# EAGLE schematic SDMAC (EAGLE 9.6.2)

## Sheet 1 of 3
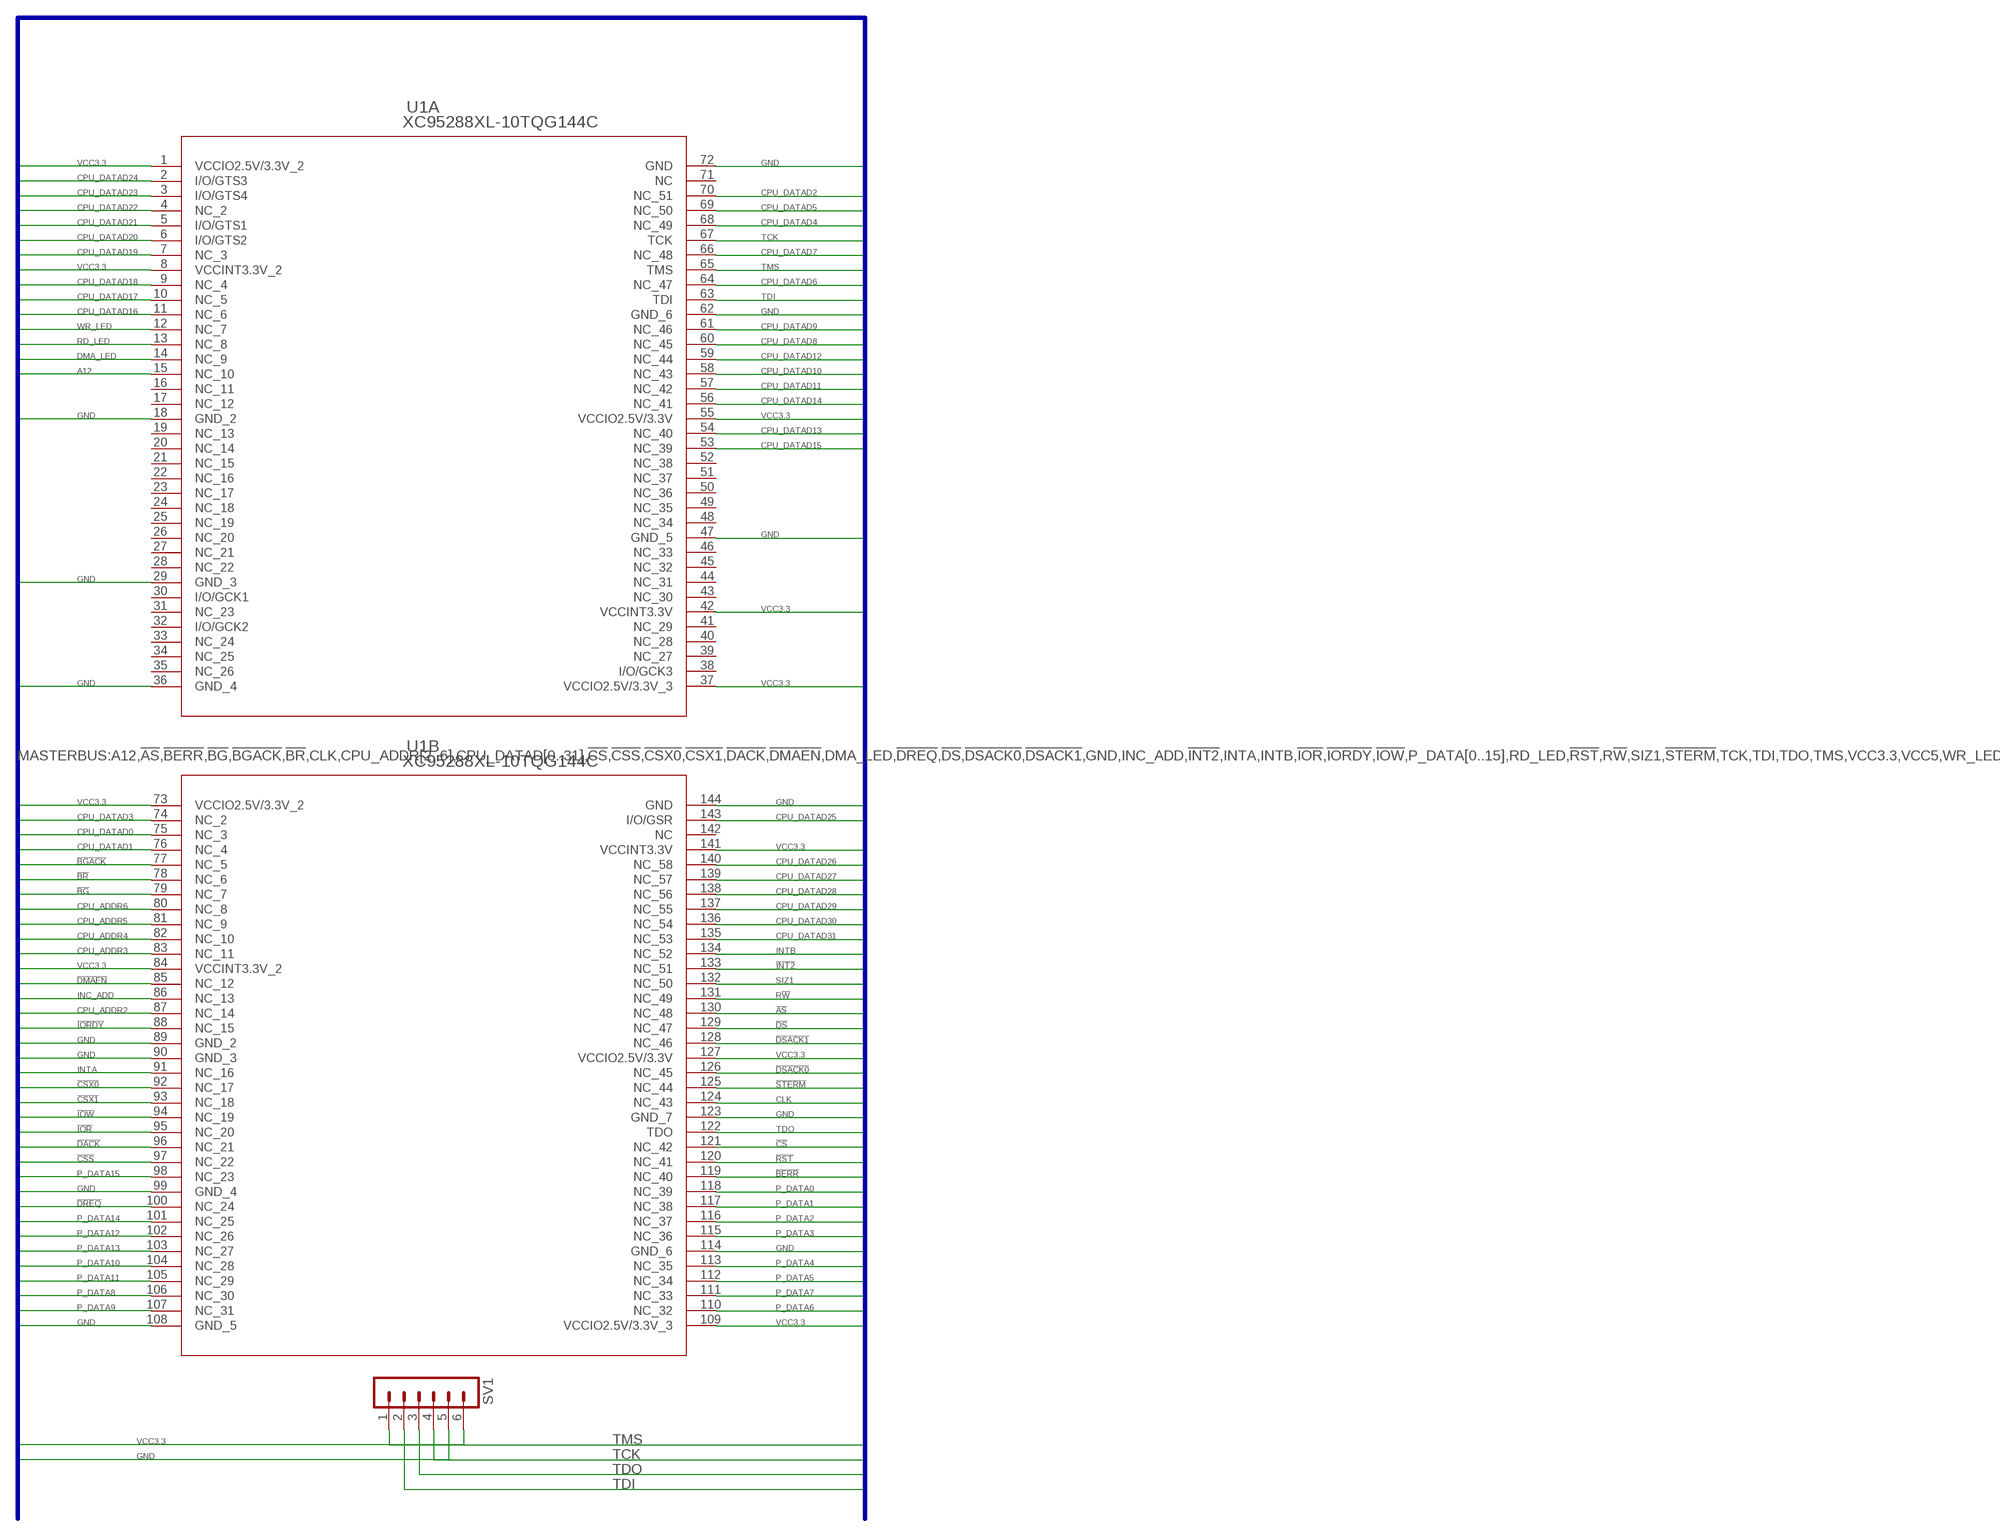
[diagram p0: schematic, sheet 1]

### Parts
SV1  MA06-1  [MA06-1]
U1  XC95288XL-10TQG144C  [144-TQFP_XIL]

### Nets
!AS: U1.130(B:NC_48) ; also sheet 2
!BERR: U1.119(B:NC_40) ; also sheet 2
!BG: U1.79(B:NC_7) ; also sheet 2
!BGACK: U1.77(B:NC_5) ; also sheet 2
!BR: U1.78(B:NC_6) ; also sheet 2
!CS: U1.121(B:NC_42) ; also sheet 2
!CSS: U1.97(B:NC_22) ; also sheet 2
!CSX0: U1.92(B:NC_17) ; also sheet 2
!CSX1: U1.93(B:NC_18) ; also sheet 2
!DACK: U1.96(B:NC_21) ; also sheet 2
!DMAEN: U1.85(B:NC_12) ; also sheet 2
!DREQ: U1.100(B:NC_24) ; also sheet 2
!DS: U1.129(B:NC_47) ; also sheet 2
!DSACK0: U1.126(B:NC_45) ; also sheet 2
!DSACK1: U1.128(B:NC_46) ; also sheet 2
!INT2: U1.133(B:NC_51) ; also sheet 2
!IOR: U1.95(B:NC_20) ; also sheet 2
!IORDY: U1.88(B:NC_15) ; also sheet 2
!IOW: U1.94(B:NC_19) ; also sheet 2
!RST: U1.120(B:NC_41) ; also sheet 2
!STERM: U1.125(B:NC_44) ; also sheet 2
A12: U1.15(A:NC_10) ; also sheet 3
CLK: U1.124(B:NC_43) ; also sheet 2
CPU_ADDR2: U1.87(B:NC_14) ; also sheet 2
CPU_ADDR3: U1.83(B:NC_11) ; also sheet 2
CPU_ADDR4: U1.82(B:NC_10) ; also sheet 2
CPU_ADDR5: U1.81(B:NC_9) ; also sheet 2
CPU_ADDR6: U1.80(B:NC_8) ; also sheet 2
CPU_DATAD0: U1.75(B:NC_3) ; also sheet 2
CPU_DATAD1: U1.76(B:NC_4) ; also sheet 2
CPU_DATAD2: U1.70(A:NC_51) ; also sheet 2
CPU_DATAD3: U1.74(B:NC_2) ; also sheet 2
CPU_DATAD4: U1.68(A:NC_49) ; also sheet 2
CPU_DATAD5: U1.69(A:NC_50) ; also sheet 2
CPU_DATAD6: U1.64(A:NC_47) ; also sheet 2
CPU_DATAD7: U1.66(A:NC_48) ; also sheet 2
CPU_DATAD8: U1.60(A:NC_45) ; also sheet 2
CPU_DATAD9: U1.61(A:NC_46) ; also sheet 2
CPU_DATAD10: U1.58(A:NC_43) ; also sheet 2
CPU_DATAD11: U1.57(A:NC_42) ; also sheet 2
CPU_DATAD12: U1.59(A:NC_44) ; also sheet 2
CPU_DATAD13: U1.54(A:NC_40) ; also sheet 2
CPU_DATAD14: U1.56(A:NC_41) ; also sheet 2
CPU_DATAD15: U1.53(A:NC_39) ; also sheet 2
CPU_DATAD16: U1.11(A:NC_6) ; also sheet 2
CPU_DATAD17: U1.10(A:NC_5) ; also sheet 2
CPU_DATAD18: U1.9(A:NC_4) ; also sheet 2
CPU_DATAD19: U1.7(A:NC_3) ; also sheet 2
CPU_DATAD20: U1.6(A:I/O/GTS2) ; also sheet 2
CPU_DATAD21: U1.5(A:I/O/GTS1) ; also sheet 2
CPU_DATAD22: U1.4(A:NC_2) ; also sheet 2
CPU_DATAD23: U1.3(A:I/O/GTS4) ; also sheet 2
CPU_DATAD24: U1.2(A:I/O/GTS3) ; also sheet 2
CPU_DATAD25: U1.143(B:I/O/GSR) ; also sheet 2
CPU_DATAD26: U1.140(B:NC_58) ; also sheet 2
CPU_DATAD27: U1.139(B:NC_57) ; also sheet 2
CPU_DATAD28: U1.138(B:NC_56) ; also sheet 2
CPU_DATAD29: U1.137(B:NC_55) ; also sheet 2
CPU_DATAD30: U1.136(B:NC_54) ; also sheet 2
CPU_DATAD31: U1.135(B:NC_53) ; also sheet 2
DMA_LED: U1.14(A:NC_9) ; also sheet 3
GND: SV1.5 U1.18(A:GND_2) U1.29(A:GND_3) U1.36(A:GND_4) U1.47(A:GND_5) U1.62(A:GND_6) U1.72(A:GND) U1.89(B:GND_2) U1.90(B:GND_3) U1.99(B:GND_4) U1.108(B:GND_5) U1.114(B:GND_6) U1.123(B:GND_7) U1.144(B:GND) ; also sheet 2,3
INC_ADD: U1.86(B:NC_13) ; also sheet 2
INTA: U1.91(B:NC_16) ; also sheet 2
INTB: U1.134(B:NC_52) ; also sheet 2
P_DATA0: U1.118(B:NC_39) ; also sheet 2
P_DATA1: U1.117(B:NC_38) ; also sheet 2
P_DATA2: U1.116(B:NC_37) ; also sheet 2
P_DATA3: U1.115(B:NC_36) ; also sheet 2
P_DATA4: U1.113(B:NC_35) ; also sheet 2
P_DATA5: U1.112(B:NC_34) ; also sheet 2
P_DATA6: U1.110(B:NC_32) ; also sheet 2
P_DATA7: U1.111(B:NC_33) ; also sheet 2
P_DATA8: U1.106(B:NC_30) ; also sheet 2
P_DATA9: U1.107(B:NC_31) ; also sheet 2
P_DATA10: U1.104(B:NC_28) ; also sheet 2
P_DATA11: U1.105(B:NC_29) ; also sheet 2
P_DATA12: U1.102(B:NC_26) ; also sheet 2
P_DATA13: U1.103(B:NC_27) ; also sheet 2
P_DATA14: U1.101(B:NC_25) ; also sheet 2
P_DATA15: U1.98(B:NC_23) ; also sheet 2
R!W: U1.131(B:NC_49) ; also sheet 2
RD_LED: U1.13(A:NC_8) ; also sheet 3
SIZ1: U1.132(B:NC_50) ; also sheet 2
TCK: SV1.4 U1.67(A:TCK)
TDI: SV1.2 U1.63(A:TDI)
TDO: SV1.3 U1.122(B:TDO)
TMS: SV1.1 U1.65(A:TMS)
VCC3.3: SV1.6 U1.1(A:VCCIO2.5V/3.3V_2) U1.8(A:VCCINT3.3V_2) U1.37(A:VCCIO2.5V/3.3V_3) U1.42(A:VCCINT3.3V) U1.55(A:VCCIO2.5V/3.3V) U1.73(B:VCCIO2.5V/3.3V_2) U1.84(B:VCCINT3.3V_2) U1.109(B:VCCIO2.5V/3.3V_3) U1.127(B:VCCIO2.5V/3.3V) U1.141(B:VCCINT3.3V) ; also sheet 3
WR_LED: U1.12(A:NC_7) ; also sheet 3
Unconnected: U1.16(A:NC_11) U1.17(A:NC_12) U1.19(A:NC_13) U1.20(A:NC_14) U1.21(A:NC_15) U1.22(A:NC_16) U1.23(A:NC_17) U1.24(A:NC_18) U1.25(A:NC_19) U1.26(A:NC_20) U1.27(A:NC_21) U1.28(A:NC_22) U1.30(A:I/O/GCK1) U1.31(A:NC_23) U1.32(A:I/O/GCK2) U1.33(A:NC_24) U1.34(A:NC_25) U1.35(A:NC_26) U1.38(A:I/O/GCK3) U1.39(A:NC_27) U1.40(A:NC_28) U1.41(A:NC_29) U1.43(A:NC_30) U1.44(A:NC_31) U1.45(A:NC_32) U1.46(A:NC_33) U1.48(A:NC_34) U1.49(A:NC_35) U1.50(A:NC_36) U1.51(A:NC_37) U1.52(A:NC_38) U1.71(A:NC) U1.142(B:NC)

### Buses
MASTERBUS:A12,!AS,!BERR,!BG,!BGACK,!BR,CLK,CPU_ADDR[2..6],CPU_DATAD[0..31],!CS,!CSS,!CSX0,!CSX1,!DACK,!DMAEN,DMA_LED,!DREQ,!DS,!DSACK0,!DSACK1,GND,INC_ADD,!INT2,INTA,INTB,!IOR,!IORDY,!IOW,P_DATA[0..15],RD_LED,!RST,R!W,SIZ1,!STERM,TCK,TDI,TDO,TMS,VCC3.3,VCC5,WR_LED

## Sheet 2 of 3
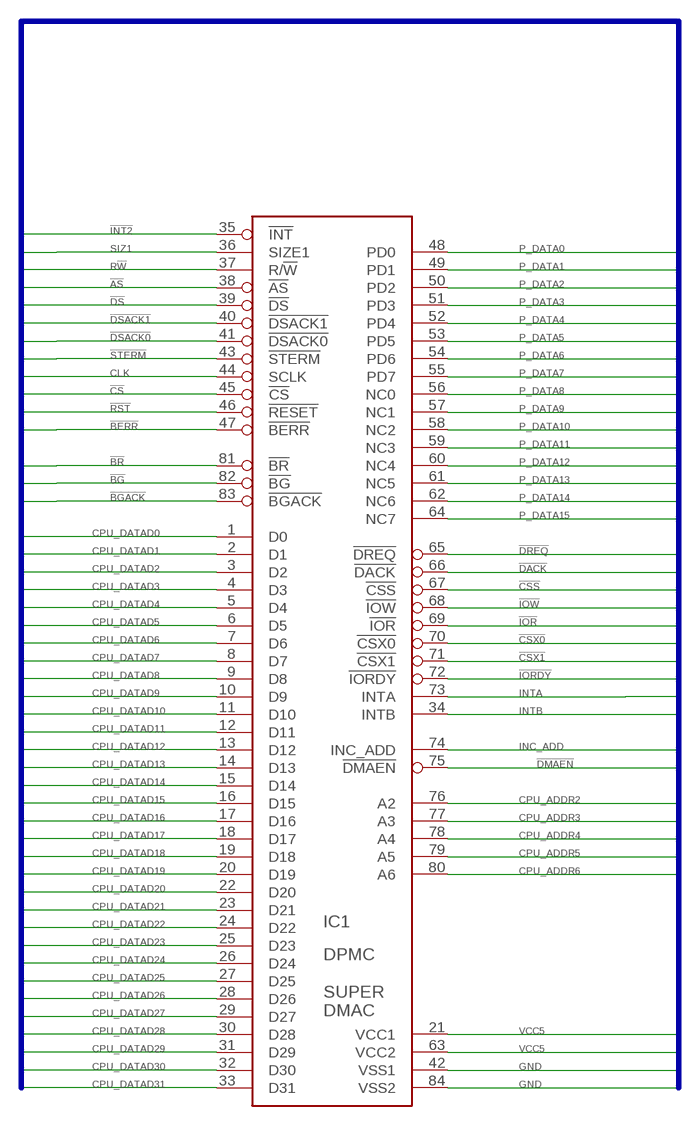
[diagram p1: schematic, sheet 2]

### Parts
IC1  SUPER_DMAC_THT  [PLCC84_T]

### Nets
!AS: IC1.38(!AS) ; also sheet 1
!BERR: IC1.47(!BERR) ; also sheet 1
!BG: IC1.82(!BG) ; also sheet 1
!BGACK: IC1.83(!BGACK) ; also sheet 1
!BR: IC1.81(!BR) ; also sheet 1
!CS: IC1.45(!CS) ; also sheet 1
!CSS: IC1.67(!CSS) ; also sheet 1
!CSX0: IC1.70(!CSX0) ; also sheet 1
!CSX1: IC1.71(!CSX1) ; also sheet 1
!DACK: IC1.66(!DACK) ; also sheet 1
!DMAEN: IC1.75(!DMAEN) ; also sheet 1
!DREQ: IC1.65(!DREQ) ; also sheet 1
!DS: IC1.39(!DS) ; also sheet 1
!DSACK0: IC1.41(!DSACK0) ; also sheet 1
!DSACK1: IC1.40(!DSACK1) ; also sheet 1
!INT2: IC1.35(!INT) ; also sheet 1
!IOR: IC1.69(!IOR) ; also sheet 1
!IORDY: IC1.72(!IORDY) ; also sheet 1
!IOW: IC1.68(!IOW) ; also sheet 1
!RST: IC1.46(!RESET) ; also sheet 1
!STERM: IC1.43(!STERM) ; also sheet 1
CLK: IC1.44(SCLK) ; also sheet 1
CPU_ADDR2: IC1.76(A2) ; also sheet 1
CPU_ADDR3: IC1.77(A3) ; also sheet 1
CPU_ADDR4: IC1.78(A4) ; also sheet 1
CPU_ADDR5: IC1.79(A5) ; also sheet 1
CPU_ADDR6: IC1.80(A6) ; also sheet 1
CPU_DATAD0: IC1.1(D0) ; also sheet 1
CPU_DATAD1: IC1.2(D1) ; also sheet 1
CPU_DATAD2: IC1.3(D2) ; also sheet 1
CPU_DATAD3: IC1.4(D3) ; also sheet 1
CPU_DATAD4: IC1.5(D4) ; also sheet 1
CPU_DATAD5: IC1.6(D5) ; also sheet 1
CPU_DATAD6: IC1.7(D6) ; also sheet 1
CPU_DATAD7: IC1.8(D7) ; also sheet 1
CPU_DATAD8: IC1.9(D8) ; also sheet 1
CPU_DATAD9: IC1.10(D9) ; also sheet 1
CPU_DATAD10: IC1.11(D10) ; also sheet 1
CPU_DATAD11: IC1.12(D11) ; also sheet 1
CPU_DATAD12: IC1.13(D12) ; also sheet 1
CPU_DATAD13: IC1.14(D13) ; also sheet 1
CPU_DATAD14: IC1.15(D14) ; also sheet 1
CPU_DATAD15: IC1.16(D15) ; also sheet 1
CPU_DATAD16: IC1.17(D16) ; also sheet 1
CPU_DATAD17: IC1.18(D17) ; also sheet 1
CPU_DATAD18: IC1.19(D18) ; also sheet 1
CPU_DATAD19: IC1.20(D19) ; also sheet 1
CPU_DATAD20: IC1.22(D20) ; also sheet 1
CPU_DATAD21: IC1.23(D21) ; also sheet 1
CPU_DATAD22: IC1.24(D22) ; also sheet 1
CPU_DATAD23: IC1.25(D23) ; also sheet 1
CPU_DATAD24: IC1.26(D24) ; also sheet 1
CPU_DATAD25: IC1.27(D25) ; also sheet 1
CPU_DATAD26: IC1.28(D26) ; also sheet 1
CPU_DATAD27: IC1.29(D27) ; also sheet 1
CPU_DATAD28: IC1.30(D28) ; also sheet 1
CPU_DATAD29: IC1.31(D29) ; also sheet 1
CPU_DATAD30: IC1.32(D30) ; also sheet 1
CPU_DATAD31: IC1.33(D31) ; also sheet 1
GND: IC1.42(VSS1) IC1.84(VSS2) ; also sheet 1,3
INC_ADD: IC1.74(INC_ADD) ; also sheet 1
INTA: IC1.73(INTA) ; also sheet 1
INTB: IC1.34(INTB) ; also sheet 1
P_DATA0: IC1.48(PD0) ; also sheet 1
P_DATA1: IC1.49(PD1) ; also sheet 1
P_DATA2: IC1.50(PD2) ; also sheet 1
P_DATA3: IC1.51(PD3) ; also sheet 1
P_DATA4: IC1.52(PD4) ; also sheet 1
P_DATA5: IC1.53(PD5) ; also sheet 1
P_DATA6: IC1.54(PD6) ; also sheet 1
P_DATA7: IC1.55(PD7) ; also sheet 1
P_DATA8: IC1.56(NC0) ; also sheet 1
P_DATA9: IC1.57(NC1) ; also sheet 1
P_DATA10: IC1.58(NC2) ; also sheet 1
P_DATA11: IC1.59(NC3) ; also sheet 1
P_DATA12: IC1.60(NC4) ; also sheet 1
P_DATA13: IC1.61(NC5) ; also sheet 1
P_DATA14: IC1.62(NC6) ; also sheet 1
P_DATA15: IC1.64(NC7) ; also sheet 1
R!W: IC1.37(R/!W!) ; also sheet 1
SIZ1: IC1.36(SIZE1) ; also sheet 1
VCC5: IC1.21(VCC1) IC1.63(VCC2) ; also sheet 3

### Buses
!AS,!BERR,!BG,!BGACK,!BR,CLK,CPU_ADDR[2..6],CPU_DATAD[0..31],!CS,!CSS,!CSX0,!CSX1,!DACK,!DMAEN,!DREQ,!DS,!DSACK0,!DSACK1,GND,INC_ADD,!INT2,INTA,INTB,!IOR,!IORDY,!IOW,P_DATA[0..15],!RST,R!W,SIZ1,!STERM,TCK,TDI,TDO,TMS,VCC3.3,VCC5

## Sheet 3 of 3
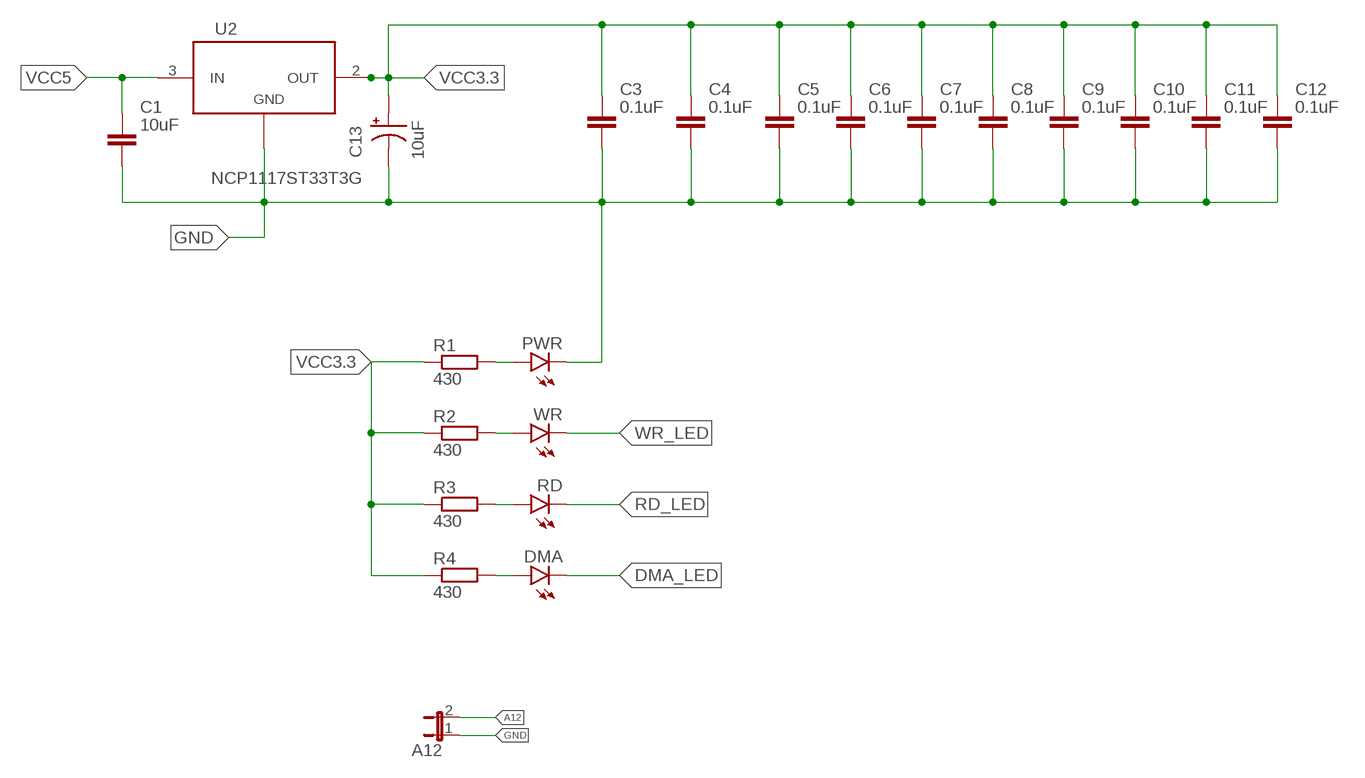
[diagram p2: schematic, sheet 3]

### Parts
A12  JP1E  [JP1]
C1  10uF  C_CHIP-0805(2012-METRIC)  [CAPC2012X110]
C3  0.1uF  C_CHIP-0805(2012-METRIC)  [CAPC2012X110]
C4  0.1uF  C_CHIP-0805(2012-METRIC)  [CAPC2012X110]
C5  0.1uF  C_CHIP-0805(2012-METRIC)  [CAPC2012X110]
C6  0.1uF  C_CHIP-0805(2012-METRIC)  [CAPC2012X110]
C7  0.1uF  C_CHIP-0805(2012-METRIC)  [CAPC2012X110]
C8  0.1uF  C_CHIP-0805(2012-METRIC)  [CAPC2012X110]
C9  0.1uF  C_CHIP-0805(2012-METRIC)  [CAPC2012X110]
C10  0.1uF  C_CHIP-0805(2012-METRIC)  [CAPC2012X110]
C11  0.1uF  C_CHIP-0805(2012-METRIC)  [CAPC2012X110]
C12  0.1uF  C_CHIP-0805(2012-METRIC)  [CAPC2012X110]
C13  10uF  T491A106K010AT  [A]
DMA  LEDSML0805  [SML0805]
PWR  LEDSML0805  [SML0805]
R1  430  R-EU_R0805  [R0805]
R2  430  R-EU_R0805  [R0805]
R3  430  R-EU_R0805  [R0805]
R4  430  R-EU_R0805  [R0805]
RD  LEDSML0805  [SML0805]
U2  NCP1117ST33T3G  [SOT-223]
WR  LEDSML0805  [SML0805]

### Nets
A12: A12.2 ; also sheet 1
DMA_LED: DMA.C ; also sheet 1
GND: A12.1 C1.2 C3.2 C4.2 C5.2 C6.2 C7.2 C8.2 C9.2 C10.2 C11.2 C12.2 C13.C PWR.C U2.1(ADJ/GND) ; also sheet 1,2
N$1: PWR.A R1.2
N$2: R2.2 WR.A
N$3: R3.2 RD.A
N$4: DMA.A R4.2
RD_LED: RD.C ; also sheet 1
VCC3.3: C3.1 C4.1 C5.1 C6.1 C7.1 C8.1 C9.1 C10.1 C11.1 C12.1 C13.A R1.1 R2.1 R3.1 R4.1 U2.2(OUT) U2.4 ; also sheet 1
VCC5: C1.1 U2.3(IN) ; also sheet 2
WR_LED: WR.C ; also sheet 1

## Library data of the parts
A12 = jumper:JP1E: JUMPER
C1 C3-C12 = Capacitor:C: Capacitor - Generic; CATEGORY: Capacitor
C13 = Volks73-Kemet:T491?*: Tantalum Surface Mount Capacitor - Standard Tantalum T491 Series Industrial Grade MnO2 Documentation Datasheet <http://www.kemet.com/Lists/ProductCatalog/Attachments/254/KEM_T2005_T491.pdf> Overview The KEMET T491 Series, designed specifially for today’s highly automated surface mount processes and equipment, is the leading choice for surface mount designs. The T491 combines KEMET’s proven solid tantalum technology, acclaimed and respected throughout the world, with the latest in materials, processes and automation, resulting in unsurpassed total performance and value. This product meets or exceeds the requirements of EIA standard 535BAAC. This series is classifid as MSL (Moisture Sensitivity Level) 1 under J STD 020: unlimited flor life time at ≤30°C / 85% RH. The T491 standard terminations are available in 100% matte tin and provide excellent wetting characteristics and compatibility with today's surface mount solder systems. Tin/lead (Sn/Pb) terminations are available upon request for any part number. Gold-plated terminations are also available for use with conductive epoxy attachment processes. Standard packaging of these devices is tape and reel in accordance with EIA 481. This system provides perfect compatibility with all tape-fed placement units. Benefits Meets or exceeds EIA Standard 535BAAC Taped and reeled per EIA 481 Symmetrical, compliant terminations Optional gold-plated terminations Laser-marked case 100% surge current test on C, D, E, U, V, X sizes Halogen free epoxy Capacitance 0.1 µF to 1,000 µF Tolerance ±10%, ±20% Voltage 2.5 – 50 VDC Extended range values Low profie case sizes RoHS Compliant and lead-free terminations (See www.kemet.com for transition information) Operating temperature: -55ºC to +125ºC; CAPACITANCE: 10µF; CATEGORY: Capacitors; DESCRIPTION: CAP TANT 10UF 10V 10% 1206; DOCUMENTATION_LINK: <a href="http://www.kemet.com/Lists/ProductCatalog/Attachments/254/KEM_T2005_T491.pdf">Datasheet</a>; DOCUMENTATION_URL: http://www.kemet.com/Lists/ProductCatalog/Attachments/254/KEM_T2005_T491.pdf; ESR: 3.8 Ohm; FAMILY: Tantalum Capacitors; FEATURES: General Purpose; HEIGHT: 0.071" (1.80mm); LEAD_SPACING: -; LIFETIME_AT_TEMP: 2000 Hrs @ 85°C; MANUFACTURER: Kemet; MANUFACTURER_SIZE_CODE: A; MOUNTING_TYPE: Surface Mount; OPERATING_TEMPERATURE: -55°C ~ 125°C; PACKAGE: 1206 (3216 Metric); PART_NUMBER: T491A106K010AT; SERIES: T491; SIZE: 0.126" L x 0.063" W (3.20mm x 1.60mm); SUPPLIER_ITEM_LINK: <a href="http://www.digikey.com/product-detail/en/T491A106K010AT/399-3684-1-ND/819009">Details</a>; SUPPLIER_ITEM_NUMBER: 399-3684-1-ND; SUPPLIER_ITEM_URL: http://www.digikey.com/product-detail/en/T491A106K010AT/399-3684-1-ND/819009; SUPPLIER_LINK: <a href="http://www.digikey.com">Home Page</a>; SUPPLIER_NAME: Digi-Key; SUPPLIER_URL: http://www.digikey.com; TOLERANCE: ±10%; TYPE: Molded; VOLTAGE-RATED: 10V
DMA PWR RD WR = led:LED: LED OSRAM: - CHIPLED LG R971, LG N971, LY N971, LG Q971, LY Q971, LO R971, LY R971 LH N974, LH R974 LS Q976, LO Q976, LY Q976 LO Q996 - Hyper CHIPLED LW Q18S LB Q993, LB Q99A, LB R99A - SideLED LS A670, LO A670, LY A670, LG A670, LP A670 LB A673, LV A673, LT A673, LW A673 LH A674 LY A675 LS A676, LA A676, LO A676, LY A676, LW A676 LS A679, LY A679, LG A679 - Hyper Micro SIDELED® LS Y876, LA Y876, LO Y876, LY Y876 LT Y87S - SmartLED LW L88C, LW L88S LB L89C, LB L89S, LG L890 LS L89K, LO L89K, LY L89K LS L896, LA L896, LO L896, LY L896 - TOPLED LS T670, LO T670, LY T670, LG T670, LP T670 LSG T670, LSP T670, LSY T670, LOP T670, LYG T670 LG T671, LOG T671, LSG T671 LB T673, LV T673, LT T673, LW T673 LH T674 LS T676, LA T676, LO T676, LY T676, LB T676, LH T676, LSB T676, LW T676 LB T67C, LV T67C, LT T67C, LS T67K, LO T67K, LY T67K, LW E67C LS E67B, LA E67B, LO E67B, LY E67B, LB E67C, LV E67C, LT E67C LW T67C LS T679, LY T679, LG T679 LS T770, LO T770, LY T770, LG T770, LP T770 LB T773, LV T773, LT T773, LW T773 LH T774 LS E675, LA E675, LY E675, LS T675 LS T776, LA T776, LO T776, LY T776, LB T776 LHGB T686 LT T68C, LB T68C - Hyper Mini TOPLED® LB M676 - Mini TOPLED Santana® LG M470 LS M47K, LO M47K, LY M47K Source: http://www.osram.convergy.de LUXEON: - LUMILED® LXK2-PW12-R00, LXK2-PW12-S00, LXK2-PW14-U00, LXK2-PW14-V00 LXK2-PM12-R00, LXK2-PM12-S00, LXK2-PM14-U00 LXK2-PE12-Q00, LXK2-PE12-R00, LXK2-PE12-S00, LXK2-PE14-T00, LXK2-PE14-U00 LXK2-PB12-K00, LXK2-PB12-L00, LXK2-PB12-M00, LXK2-PB14-N00, LXK2-PB14-P00, LXK2-PB14-Q00 LXK2-PR12-L00, LXK2-PR12-M00, LXK2-PR14-Q00, LXK2-PR14-R00 LXK2-PD12-Q00, LXK2-PD12-R00, LXK2-PD12-S00 LXK2-PH12-R00, LXK2-PH12-S00 LXK2-PL12-P00, LXK2-PL12-Q00, LXK2-PL12-R00 Source: www.luxeon.com KINGBRIGHT: KA-3528ASYC Source: www.kingbright.com
IC1 = Amiga:SUPER_DMAC
R1-R4 = rcl:R-EU_: RESISTOR, European symbol; SPICEPREFIX: R
SV1 = con-lstb:MA06-1: PIN HEADER; OC_FARNELL: unknown; OC_NEWARK: unknown; SPICEPREFIX: X
U1 = XilinxXC95288:XC95288XL-10TQG144C; COPYRIGHT: Copyright (C) 2022 Ultra Librarian. All rights reserved.; MANUFACTURER_PART_NUMBER: XC95288XL-10TQG144C; MFR_NAME: Xilinx Inc
U2 = IC:NCP1117ST33T3G: IC REG LINEAR 3.3V 1A SOT223 Manufacturer's datasheet <https://www.onsemi.com/pub/Collateral/NCP1117-D.PDF>; CREATED_BY: PCBLayout.com; DIGIKEY_PART_NUMBER: NCP1117ST33T3GOSTR-ND; MANUFACTURER: ON Semiconductor; MPN: NCP1117ST33T3G; PACKAGE: SOT-223